# EAGLE design Registers (EAGLE 7.6.0)
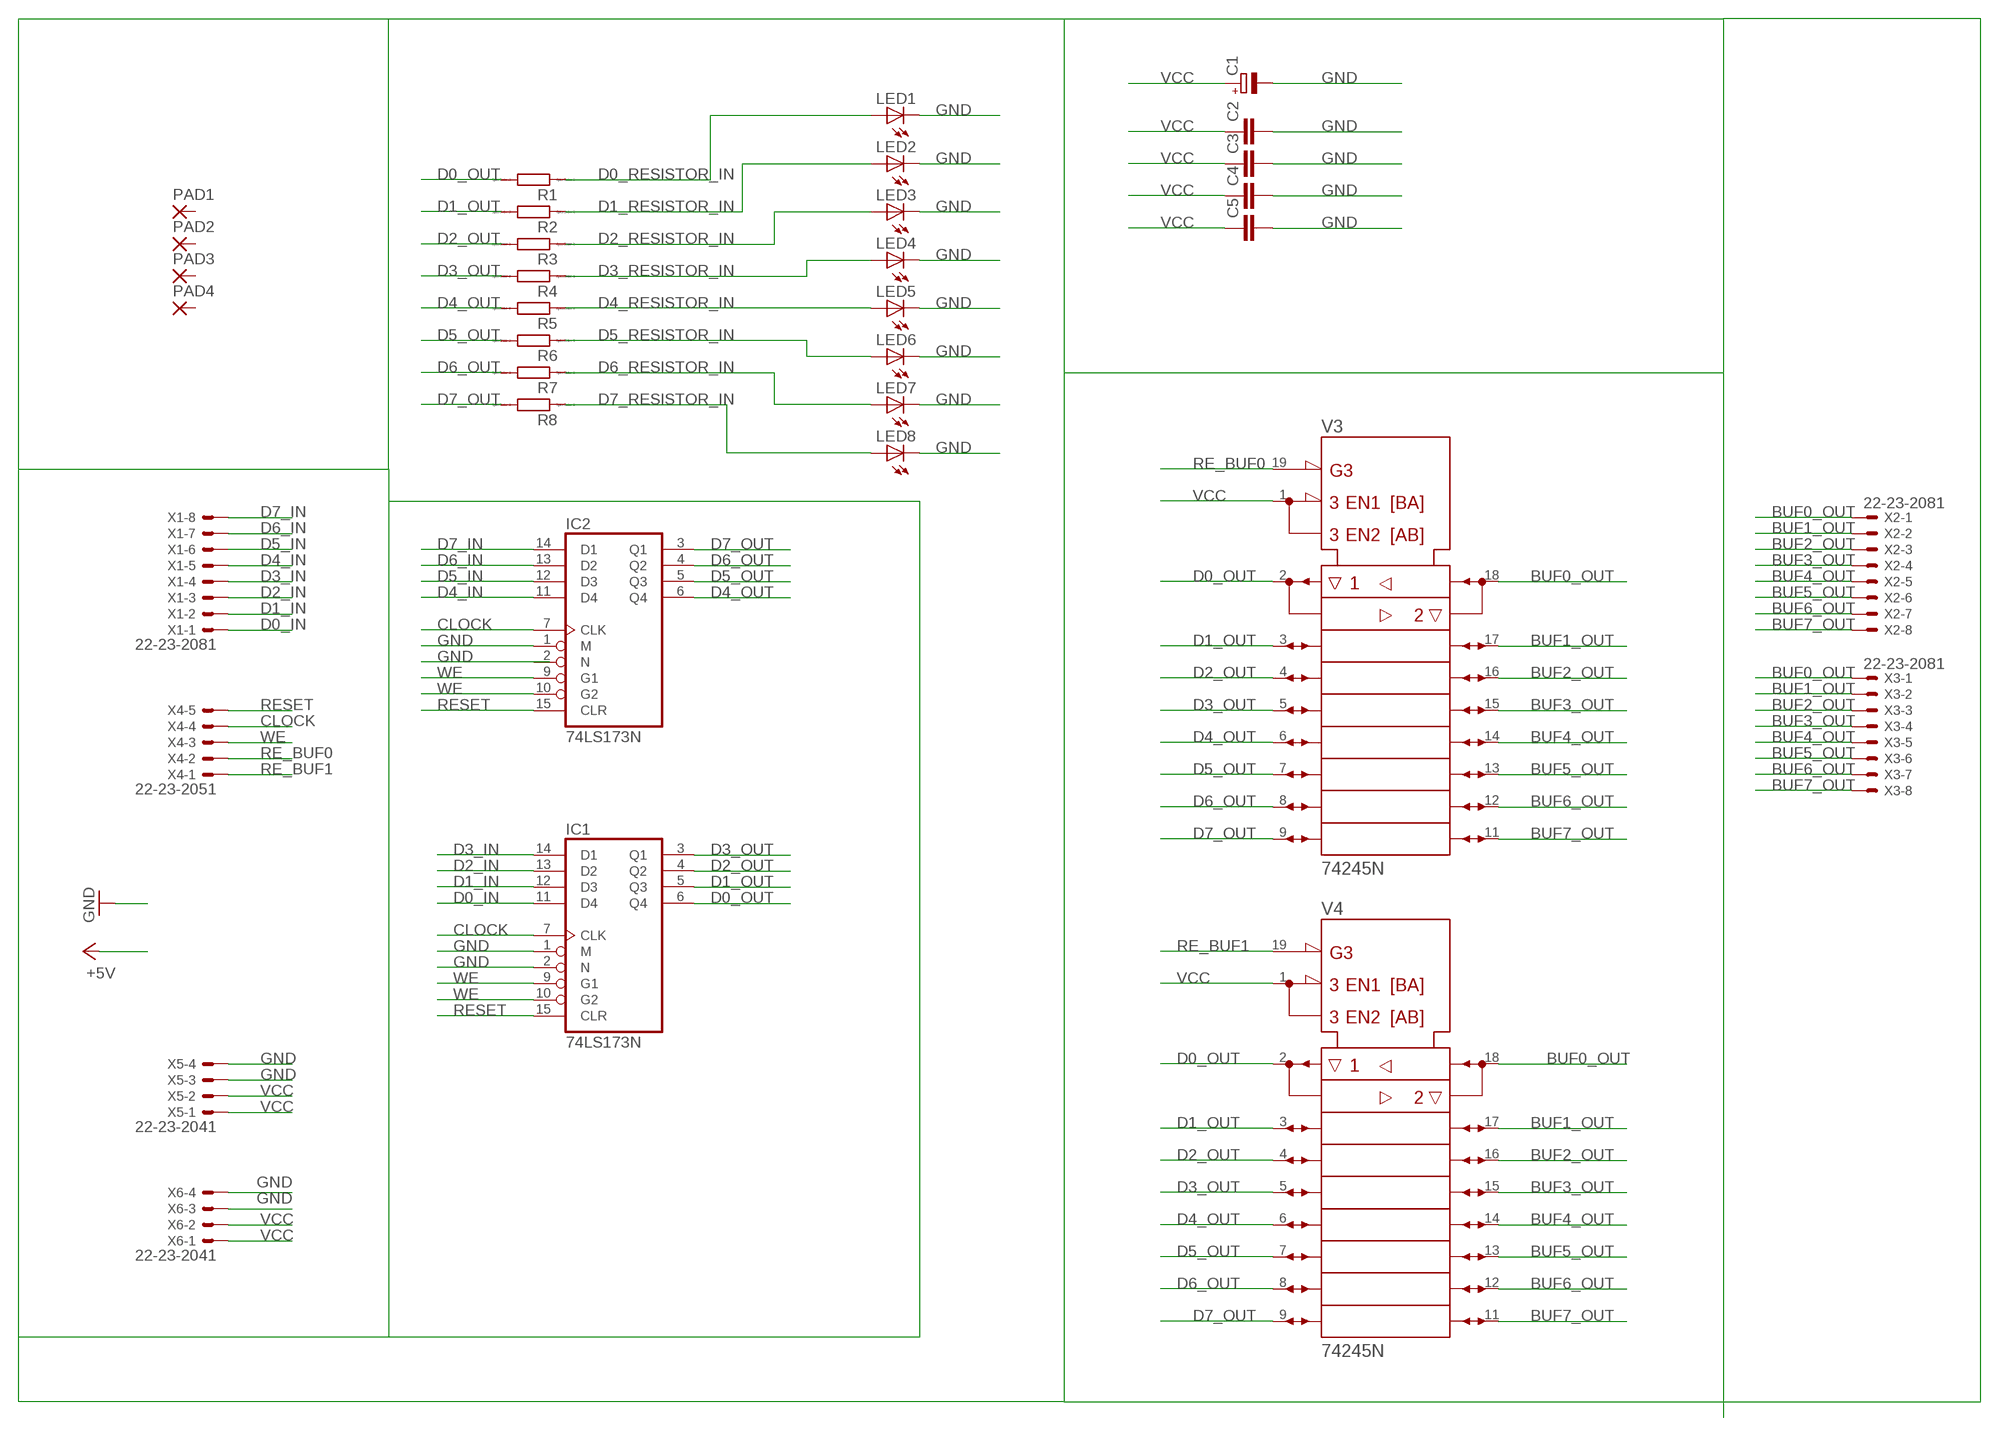
[diagram p0: schematic, sheet 1]

## Parts
C1  CPOL-EUE2.5-6  [E2,5-6]
C2  C-EU025-025X050  [C025-025X050]
C3  C-EU025-025X050  [C025-025X050]
C4  C-EU025-025X050  [C025-025X050]
C5  C-EU025-025X050  [C025-025X050]
IC1  74LS173N  [DIL16]
IC2  74LS173N  [DIL16]
LED1  LED5MM  [LED5MM]
LED2  LED5MM  [LED5MM]
LED3  LED5MM  [LED5MM]
LED4  LED5MM  [LED5MM]
LED5  LED5MM  [LED5MM]
LED6  LED5MM  [LED5MM]
LED7  LED5MM  [LED5MM]
LED8  LED5MM  [LED5MM]
PAD1  2,54/1,1  [2,54/1,1]
PAD2  2,54/1,1  [2,54/1,1]
PAD3  2,54/1,1  [2,54/1,1]
PAD4  2,54/1,1  [2,54/1,1]
R1  R0207/10  [0207/10]
R2  R0207/10  [0207/10]
R3  R0207/10  [0207/10]
R4  R0207/10  [0207/10]
R5  R0207/10  [0207/10]
R6  R0207/10  [0207/10]
R7  R0207/10  [0207/10]
R8  R0207/10  [0207/10]
V3  74245N  [DIL20]
V4  74245N  [DIL20]
X1  22-23-2081  [22-23-2081]
X2  22-23-2081  [22-23-2081]
X3  22-23-2081  [22-23-2081]
X4  22-23-2051  [22-23-2051]
X5  22-23-2041  [22-23-2041]
X6  22-23-2041  [22-23-2041]

## Nets
BUF0_OUT: V3.18(B1) V4.18(B1) X2.1 X3.1
BUF1_OUT: V3.17(B2) V4.17(B2) X2.2 X3.2
BUF2_OUT: V3.16(B3) V4.16(B3) X2.3 X3.3
BUF3_OUT: V3.15(B4) V4.15(B4) X2.4 X3.4
BUF4_OUT: V3.14(B5) V4.14(B5) X2.5 X3.5
BUF5_OUT: V3.13(B6) V4.13(B6) X2.6 X3.6
BUF6_OUT: V3.12(B7) V4.12(B7) X2.7 X3.7
BUF7_OUT: V3.11(B8) V4.11(B8) X2.8 X3.8
CLOCK: IC1.7(CLK) IC2.7(CLK) X4.4
D0_IN: IC1.11(D4) X1.1
D0_OUT: IC1.6(Q4) R1.2 V3.2(A1) V4.2(A1)
D0_RESISTOR_IN: LED1.A R1.1
D1_IN: IC1.12(D3) X1.2
D1_OUT: IC1.5(Q3) R2.2 V3.3(A2) V4.3(A2)
D1_RESISTOR_IN: LED2.A R2.1
D2_IN: IC1.13(D2) X1.3
D2_OUT: IC1.4(Q2) R3.2 V3.4(A3) V4.4(A3)
D2_RESISTOR_IN: LED3.A R3.1
D3_IN: IC1.14(D1) X1.4
D3_OUT: IC1.3(Q1) R4.2 V3.5(A4) V4.5(A4)
D3_RESISTOR_IN: LED4.A R4.1
D4_IN: IC2.11(D4) X1.5
D4_OUT: IC2.6(Q4) R5.2 V3.6(A5) V4.6(A5)
D4_RESISTOR_IN: LED5.A R5.1
D5_IN: IC2.12(D3) X1.6
D5_OUT: IC2.5(Q3) R6.2 V3.7(A6) V4.7(A6)
D5_RESISTOR_IN: LED6.A R6.1
D6_IN: IC2.13(D2) X1.7
D6_OUT: IC2.4(Q2) R7.2 V3.8(A7) V4.8(A7)
D6_RESISTOR_IN: LED7.A R7.1
D7_IN: IC2.14(D1) X1.8
D7_OUT: IC2.3(Q1) R8.2 V3.9(A8) V4.9(A8)
D7_RESISTOR_IN: LED8.A R8.1
GND [supply]: C1.- C2.2 C3.2 C4.2 C5.2 IC1.1(M) IC1.2(N) IC2.1(M) LED1.K(C) LED2.K(C) LED3.K(C) LED4.K(C) LED5.K(C) LED6.K(C) LED7.K(C) LED8.K(C) X5.3 X5.4 X6.3 X6.4
RE_BUF0: V3.19(!G) X4.2
RE_BUF1: V4.19(!G) X4.1
RESET: IC1.15(CLR) IC2.15(CLR) X4.5
VCC [supply]: C1.+ C2.1 C3.1 C4.1 C5.1 V3.1(DIR) V4.1(DIR) X5.1 X5.2 X6.1 X6.2 ; supply symbol labelled +5V
WE: IC1.9(G1) IC1.10(G2) IC2.9(G1) IC2.10(G2) X4.3
Unconnected: IC2.2(N) PAD1.1(P) PAD2.1(P) PAD3.1(P) PAD4.1(P)

## Power pins joined to a net without a drawn wire
GND: IC1.8(GND) IC2.8(GND) V3.10(-UB) V4.10(-UB)
VCC: IC1.16(VCC) IC2.16(VCC) V3.20(+UB) V4.20(+UB)

## Library data of the parts
C1 = rcl:CPOL-EU: POLARIZED CAPACITOR, European symbol
C2-C5 = rcl:C-EU: CAPACITOR, European symbol
IC1 IC2 = 74xx-us:74*173: 4-bit D type REGISTER, 3-state
LED1-LED8 = led:LED: LED OSRAM: - CHIPLED LG R971, LG N971, LY N971, LG Q971, LY Q971, LO R971, LY R971 LH N974, LH R974 LS Q976, LO Q976, LY Q976 LO Q996 - Hyper CHIPLED LW Q18S LB Q993, LB Q99A, LB R99A - SideLED LS A670, LO A670, LY A670, LG A670, LP A670 LB A673, LV A673, LT A673, LW A673 LH A674 LY A675 LS A676, LA A676, LO A676, LY A676, LW A676 LS A679, LY A679, LG A679 - Hyper Micro SIDELED® LS Y876, LA Y876, LO Y876, LY Y876 LT Y87S - SmartLED LW L88C, LW L88S LB L89C, LB L89S, LG L890 LS L89K, LO L89K, LY L89K LS L896, LA L896, LO L896, LY L896 - TOPLED LS T670, LO T670, LY T670, LG T670, LP T670 LSG T670, LSP T670, LSY T670, LOP T670, LYG T670 LG T671, LOG T671, LSG T671 LB T673, LV T673, LT T673, LW T673 LH T674 LS T676, LA T676, LO T676, LY T676, LB T676, LH T676, LSB T676, LW T676 LB T67C, LV T67C, LT T67C, LS T67K, LO T67K, LY T67K, LW E67C LS E67B, LA E67B, LO E67B, LY E67B, LB E67C, LV E67C, LT E67C LW T67C LS T679, LY T679, LG T679 LS T770, LO T770, LY T770, LG T770, LP T770 LB T773, LV T773, LT T773, LW T773 LH T774 LS E675, LA E675, LY E675, LS T675 LS T776, LA T776, LO T776, LY T776, LB T776 LHGB T686 LT T68C, LB T68C - Hyper Mini TOPLED® LB M676 - Mini TOPLED Santana® LG M470 LS M47K, LO M47K, LY M47K Source: http://www.osram.convergy.de LUXEON: - LUMILED® LXK2-PW12-R00, LXK2-PW12-S00, LXK2-PW14-U00, LXK2-PW14-V00 LXK2-PM12-R00, LXK2-PM12-S00, LXK2-PM14-U00 LXK2-PE12-Q00, LXK2-PE12-R00, LXK2-PE12-S00, LXK2-PE14-T00, LXK2-PE14-U00 LXK2-PB12-K00, LXK2-PB12-L00, LXK2-PB12-M00, LXK2-PB14-N00, LXK2-PB14-P00, LXK2-PB14-Q00 LXK2-PR12-L00, LXK2-PR12-M00, LXK2-PR14-Q00, LXK2-PR14-R00 LXK2-PD12-Q00, LXK2-PD12-R00, LXK2-PD12-S00 LXK2-PH12-R00, LXK2-PH12-S00 LXK2-PL12-P00, LXK2-PL12-Q00, LXK2-PL12-R00 Source: www.luxeon.com KINGBRIGHT: KA-3528ASYC Source: www.kingbright.com
PAD1-PAD4 = wirepad:2,54/1,1: THROUGH-HOLE PAD
R1-R8 = eagle-ltspice:R: RESISTOR, European symbol; SPICEMODEL: NONE; SPICEPREFIX: R
V3 V4 = 74ttl-din:74*245: Octal BUS TRANSCEIVER, 3-state
X1-X3 = con-molex:22-23-2081: .100" (2.54mm) Center Header - 8 Pin; MF: MOLEX; MPN: 22-23-2081; OC_FARNELL: 1756826; OC_NEWARK: 01C7592
X4 = con-molex:22-23-2051: .100" (2.54mm) Center Header - 5 Pin; MF: MOLEX; MPN: 22-23-2051; OC_FARNELL: 1462952; OC_NEWARK: 38C9178
X5 X6 = con-molex:22-23-2041: .100" (2.54mm) Center Header - 4 Pin; MF: MOLEX; MPN: 22-23-2041; OC_FARNELL: 1462920; OC_NEWARK: 38C0355

## Net classes
1 supply: width 1.016 mm

## Board
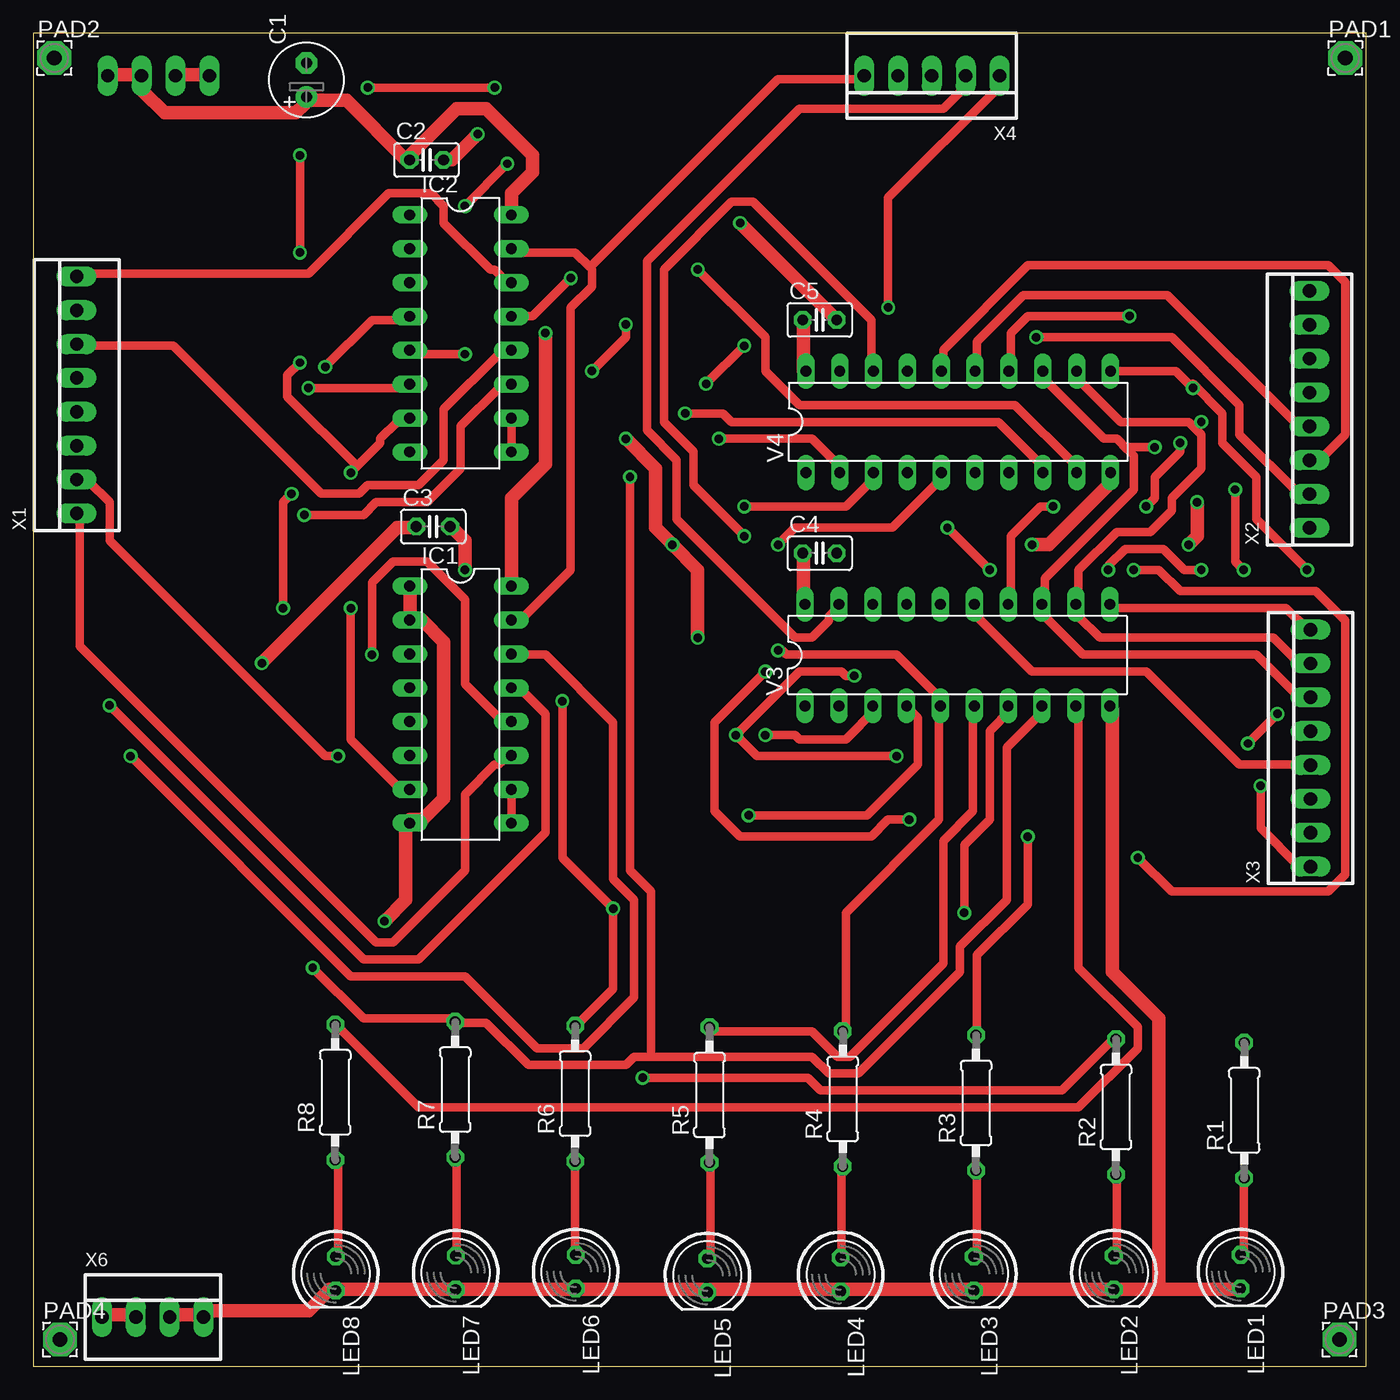
[diagram p1: board, top side]
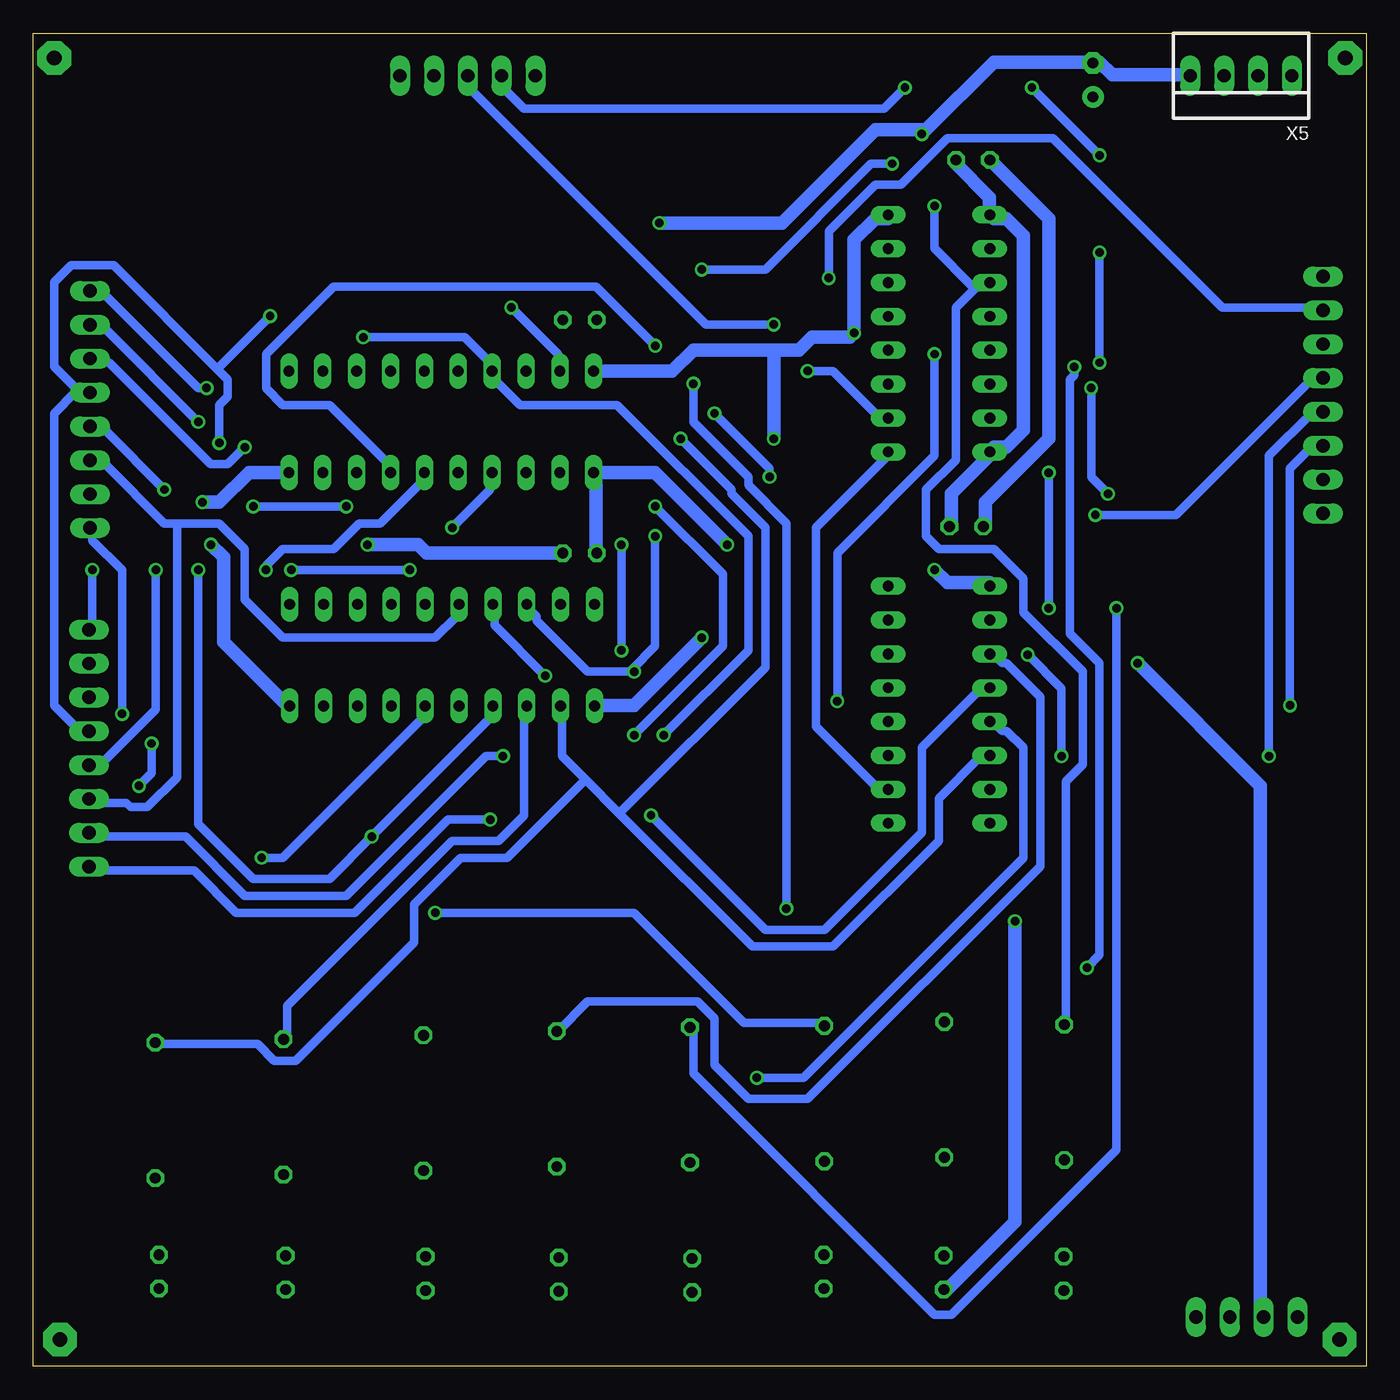
[diagram p2: board, bottom side, seen from below]

Size 100 x 100 mm. Coordinates in mm from the lower left corner, seen from the top.
Outline: 0,0 100,0 100,100 0,100 0,0
Copper layers (1*16): Top 0.035mm / dielectric 1.5mm / Bottom 0.035mm
Design rules "default *": minimum track width 25mil, minimum drill 25mil, track to track 25mil, track to pad 25mil, pad to pad 25mil, via to via 25mil, smd to smd 8mil, copper to edge 40mil, drill to drill 8mil, minimum pad ring 10mil, minimum via ring 8mil, stop-mask expansion 4mil, vias tented up to drill 0mil, thermal gap 10mil

### Footprints (pad centres in the part's own frame; a part is rotated, then mirrored left to right if it is on the bottom)
E2,5-6 = drill 0.813 pad 1.6: + -1.27,0 | drill 0.813 pad 1.6 octagon: - 1.27,0
C025-025X050 = drill 0.813 octagon: 1 -1.27,0; 2 1.27,0
DIL16 = drill 0.813 long: 1 -8.89,-3.81; 2 -6.35,-3.81; 3 -3.81,-3.81; 4 -1.27,-3.81; 5 1.27,-3.81; 6 3.81,-3.81; 7 6.35,-3.81; 8 8.89,-3.81; 9 8.89,3.81; 10 6.35,3.81; 11 3.81,3.81; 12 1.27,3.81; 13 -1.27,3.81; 14 -3.81,3.81; 15 -6.35,3.81; 16 -8.89,3.81
LED5MM = drill 0.813 octagon: A -1.27,0; K 1.27,0
2,54/1,1 = drill 1.118 pad 2.54 octagon: 1 0,0
0207/10 = drill 0.813 octagon: 1 -5.08,0; 2 5.08,0
DIL20 = drill 0.813 long: 1 -11.43,-3.81; 2 -8.89,-3.81; 3 -6.35,-3.81; 4 -3.81,-3.81; 5 -1.27,-3.81; 6 1.27,-3.81; 7 3.81,-3.81; 8 6.35,-3.81; 9 8.89,-3.81; 10 11.43,-3.81; 11 11.43,3.81; 12 8.89,3.81; 13 6.35,3.81; 14 3.81,3.81; 15 1.27,3.81; 16 -1.27,3.81; 17 -3.81,3.81; 18 -6.35,3.81; 19 -8.89,3.81; 20 -11.43,3.81
22-23-2081 = drill 1 long: 1 -8.89,0; 2 -6.35,0; 3 -3.81,0; 4 -1.27,0; 5 1.27,0; 6 3.81,0; 7 6.35,0; 8 8.89,0
22-23-2051 = drill 1 long: 1 -5.08,0; 2 -2.54,0; 3 0,0; 4 2.54,0; 5 5.08,0
22-23-2041 = drill 1 long: 1 -3.81,0; 2 -1.27,0; 3 1.27,0; 4 3.81,0

### Placement (x,y rotation side)
C1  20.5,96.5 90 top
C2  29.5,90.5 0 top
C3  30,63 0 top
C4  59,61 0 top
C5  59,78.5 0 top
IC1  32.05,49.63 270 top
IC2  32.05,77.49 270 top
LED1  90.57,7.09 270 top
LED2  81.07,7.02 270 top
LED3  70.57,6.95 270 top
LED4  60.57,6.88 270 top
LED5  50.57,6.81 270 top
LED6  40.69,7.09 270 top
LED7  31.69,7.02 270 top
LED8  22.69,6.95 270 top
PAD1  98.43,98.15 0 top
PAD2  1.58,98.15 0 top
PAD3  98,2 0 top
PAD4  2,2 0 top
R1  90.85,19.19 90 top
R2  81.23,19.45 90 top
R3  70.73,19.75 90 top
R4  60.73,20.05 90 top
R5  50.73,20.35 90 top
R6  40.65,20.45 90 top
R7  31.65,20.75 90 top
R8  22.65,20.55 90 top
V3  69.33,53.35 0 top
V4  69.39,70.85 0 top
X1  3.25,72.87 90 top
X2  95.75,71.78 90 top
X3  95.82,46.37 90 top
X4  67.41,96.82 180 top
X5  9.39,96.82 180 bottom
X6  8.96,3.68 0 top

### Tracks (layer width: path | path; a pad name or v marks a point on that pad's centre or on a via)
BUF0_OUT  (via drill 0.64)
  Top 0.635: v91.12,46.72 v93.34,48.94 | v92.08,43.55 92.08,40.37 94.93,37.51 95.57,37.51 X3.1 | v53.34,62.28 49.53,66.09 49.53,68.63 47.31,70.85 47.31,82.28 52.39,87.36 53.98,87.36 62.87,78.47 62.87,74.66 V4.18 | v65.72,41.01 64.14,41.01 62.87,39.73 53.02,39.73 51.12,41.64 51.12,48.31 v54.93,52.12
  Bottom 0.635: v93.34,48.94 93.34,59.74 95.57,61.96 95.57,62.59 X2.1 | v91.12,46.72 91.12,44.5 v92.08,43.55 | 55.09,52.28 53.34,54.02 v53.34,62.28 | 55.09,52.28 55.24,52.12 58.42,52.12 62.23,55.93 62.23,56.24 62.87,56.88 V3.18 | v65.72,41.01 68.9,41.01 75.88,34.02 84.77,34.02 87.95,37.2 95.57,37.2 X3.1 | v54.93,52.12 55.09,52.28
BUF1_OUT  (via drill 0.64)
  Top 0.635: v61.59,51.8 60.96,51.8 60.64,52.12 57.47,52.12 v52.7,47.35 54.29,45.77 v64.77,45.77 | v75.25,77.2 85.41,77.2 90.49,72.12 90.49,69.9 94.93,65.45 95.57,65.45 X2.2
  Bottom 0.635: v61.59,51.8 65.41,55.61 65.41,56.88 V3.17 | v52.7,47.35 46.35,53.7 46.35,62.28 56.2,72.12 63.5,72.12 65.41,74.03 65.41,74.66 V4.17 65.72,74.66 65.72,75.3 67.63,77.2 v75.25,77.2 | v64.77,45.77 66.04,45.77 76.52,35.29 84.14,35.29 88.58,39.73 95.57,39.73 X3.2
BUF2_OUT
  Top 0.635: V4.16 68.26,74.66 68.26,76.25 74.61,82.6 97.16,82.6 98.42,81.33 98.42,69.9 96.52,67.99 95.89,67.99 X2.3
  Bottom 0.635: 89.22,63.23 90.17,63.23 94.61,67.67 95.57,67.67 X2.3 | 89.22,63.23 86.04,63.23 84.14,61.33 84.14,57.52 81.28,54.66 69.85,54.66 68.26,56.24 68.26,56.88 V3.16 | 89.22,63.23 89.22,44.18 91.44,41.96 92.71,41.96 93.03,42.27 95.57,42.27 X3.3
BUF3_OUT  (via drill 0.64)
  Top 0.635: V4.15 70.8,74.66 70.8,76.88 74.3,80.38 85.09,80.38 94.93,70.53 95.57,70.53 X2.4 | V3.15 70.8,56.88 70.8,56.24 74.93,52.12 83.5,52.12 90.49,45.13 95.57,45.13 X3.4 | v90.17,65.77 90.17,60.37 v90.81,59.74
  Bottom 0.635: v90.17,65.77 94.61,70.22 95.57,70.22 X2.4 | v90.81,59.74 90.81,49.26 94.93,45.13 95.57,45.13 X3.4
BUF4_OUT  (via drill 0.64)
  Top 0.635: v76.52,64.5 75.56,64.5 73.34,62.28 73.34,57.2 V3.14 | v83.5,64.5 84.14,65.14 84.14,66.72 86.04,68.63 v86.04,69.26 | v82.23,78.79 74.61,78.79 73.34,77.52 73.34,74.66 V4.14
  Bottom 0.635: v83.5,64.5 v76.52,64.5 | v86.04,69.26 86.04,72.12 85.41,72.75 85.41,74.03 86.2,74.82 | 86.2,74.82 93.98,82.6 97.16,82.6 98.42,81.33 98.42,74.98 96.52,73.07 95.89,73.07 X2.5 96.84,73.07 98.42,71.48 98.42,49.58 96.52,47.67 95.89,47.67 X3.5 | 86.2,74.82 v82.23,78.79
BUF5_OUT  (via drill 0.64)
  Top 0.635: X3.6 95.57,50.21 94.93,50.21 91.76,53.39 78.74,53.39 75.88,56.24 75.88,56.88 V3.13 75.88,57.2 75.88,59.1 82.55,65.77 82.55,68.31 82.07,68.79 | 82.07,68.79 81.28,69.58 80.33,69.58 75.88,74.03 75.88,74.66 V4.13 | v84.14,68.94 82.23,68.94 82.07,68.79
  Bottom 0.635: v84.14,68.94 85.41,67.67 86.68,67.67 94.3,75.3 95.57,75.3 X2.6
BUF6_OUT  (via drill 0.64)
  Top 0.635: X3.7 95.57,52.75 94.93,52.75 93.03,54.66 80.01,54.66 78.42,56.24 78.42,56.88 V3.12 78.42,57.2 78.42,59.74 81.28,62.59 83.82,62.59 85.41,64.18 85.41,65.14 87.63,67.36 87.63,69.9 87.15,70.37 | 87.15,70.37 86.68,70.85 81.6,70.85 78.42,74.03 78.42,74.66 V4.12 | 87.15,70.37 v87.63,70.85
  Bottom 0.635: v87.63,70.85 94.61,77.83 95.57,77.83 X2.7
BUF7_OUT  (via drill 0.64)
  Top 0.635: V3.11 80.96,56.88 93.98,56.88 95.57,55.29 X3.8 | V4.11 85.72,74.66 v87,73.39 87,73.71 89.22,71.48 89.22,69.26 91.76,66.72 91.76,63.55 v95.57,59.74
  Bottom 0.635: v87,73.39 87.63,73.39 94.61,80.38 95.57,80.38 X2.8 | v95.57,59.74 95.57,55.29 X3.8
CLOCK  (via drill 0.64)
  Top 0.635: v23.81,56.88 23.81,47.04 27.3,43.55 27.94,43.55 IC1.7 | 24.29,67.52 26.04,69.26 26.04,69.58 27.3,70.85 27.94,70.85 IC2.7 | 24.29,67.52 v23.81,67.04 | v25.08,95.93 v34.61,95.93 | v20,83.55 v20,90.85 | v20,75.3 19.05,74.34 19.05,72.75 24.29,67.52
  Bottom 0.635: v23.81,67.04 v23.81,56.88 | v34.61,95.93 36.2,94.34 63.18,94.34 64.77,95.93 64.77,96.57 X4.4 | v20,90.85 v25.08,95.93 | v20,75.3 v20,83.55
D0_IN
  Top 0.635: IC1.11 35.56,45.77 34.92,45.13 34.61,45.13 32.38,42.91 32.38,37.2 26.99,31.8 25.72,31.8 3.49,54.02 3.49,63.87 X1.1
D0_OUT  (via drill 0.64)
  Top 0.635: v51.44,69.58 58.42,69.58 60.33,67.67 60.33,67.04 V4.2
  Bottom 0.635: 58.58,44.02 60.33,45.77 60.33,49.26 V3.2 | 58.58,44.02 56.04,41.48 | 56.04,41.48 46.04,31.48 40.01,31.48 32.07,39.42 32.07,42.59 28.89,45.77 28.26,45.77 IC1.6 | 58.58,44.02 64.45,38.15 67.94,38.15 71.44,34.66 71.44,31.8 80.33,22.91 81.92,22.91 83.19,24.18 90.81,24.18 R1.2 | v51.44,69.58 47.62,65.77 47.62,65.45 45.09,62.91 45.09,52.44 56.04,41.48
D0_RESISTOR_IN
  Top 0.635: LED1.A 90.81,8.62 90.81,14.02 R1.1
D1_IN  (via drill 0.64)
  Top 0.635: v25.4,53.39 25.4,58.78 26.99,60.37 29.53,60.37 32.38,57.52 32.38,51.16 34.92,48.62 35.56,48.62 IC1.12 | v22.86,45.77 21.91,45.77 5.71,61.96 5.71,64.82 4.13,66.41 3.49,66.41 X1.2
  Bottom 0.635: v25.4,53.39 22.86,50.85 v22.86,45.77
D1_OUT  (via drill 0.64)
  Top 0.635: v45.72,21.64 58.1,21.64 59.05,20.68 77.15,20.68 80.96,24.5 R2.2 | v53.34,64.5 60.96,64.5 62.87,66.41 62.87,67.04 V4.3 | v54.93,47.35 57.15,47.35 57.47,47.04 60.96,47.04 63.18,49.26 V3.3
  Bottom 0.635: v45.72,21.64 42.23,21.64 25.72,38.15 25.72,46.4 26.99,47.67 27.3,47.67 27.94,48.31 IC1.5 | V3.3 63.18,49.26 63.18,41.32 65.09,39.42 68.58,39.42 80.96,27.04 80.96,24.81 R2.2 | v53.34,64.5 48.26,59.42 48.26,54.02 v54.93,47.35
D1_RESISTOR_IN
  Top 0.635: LED2.A 81.28,8.3 81.28,14.34 R2.1
D2_IN  (via drill 0.64)
  Top 0.635: v5.71,49.58 24.77,30.53 28.89,30.53 38.42,40.05 38.42,48.94 36.51,50.85 35.88,50.85 IC1.13
  Bottom 0.635: v5.71,49.58 5.71,67.36 4.13,68.94 3.49,68.94 X1.3
D2_OUT  (via drill 0.64)
  Top 0.635: v74.61,39.73 74.61,34.66 70.8,30.84 70.8,25.13 R3.2 | v53.66,41.32 62.55,41.32 66.36,45.13 66.36,48.62 65.72,49.26 V3.4 | v71.75,59.74 v68.58,62.91 | v80.64,59.74 80.64,60.05 81.92,61.33 84.77,61.33 86.36,59.74 v87.63,59.74
  Bottom 0.635: V3.4 65.72,49.26 65.72,48.62 v74.61,39.73 77.79,36.56 83.5,36.56 87.63,40.69 v87.63,59.74 | v53.66,41.32 45.09,32.75 40.64,32.75 33.34,40.05 33.34,46.4 28.89,50.85 28.26,50.85 IC1.4 | v68.58,62.91 65.72,65.77 65.72,67.04 V4.4 | v80.64,59.74 v71.75,59.74
D2_RESISTOR_IN
  Top 0.635: LED3.A 70.8,8.3 70.8,14.65 R3.1
D3_IN  (via drill 0.64)
  Top 0.635: v7.3,45.77 23.81,29.26 32.38,29.26 37.78,23.86 41.27,23.86 45.09,27.67 45.09,34.97 43.5,36.56 43.5,48.31 38.42,53.39 35.88,53.39 IC1.14
  Bottom 0.635: v7.3,45.77 7.3,68.31 4.13,71.48 3.49,71.48 X1.4
D3_OUT  (via drill 0.64)
  Top 0.635: R4.2 60.96,25.13 60.96,34.02 67.94,41.01 67.94,49.26 V3.5 67.94,49.58 67.94,50.21 64.77,53.39 56.52,53.39 56.2,53.7 v55.88,53.7 | v55.88,61.64 57.15,62.91 64.45,62.91 67.94,66.41 67.94,67.04 V4.5
  Bottom 0.635: IC1.3 27.94,53.39 27.3,52.75 26.99,52.75 24.45,50.21 24.45,37.51 41.91,20.05 46.35,20.05 48.9,22.59 48.9,26.08 50.16,27.35 58.42,27.35 60.64,25.13 R4.2 | v55.88,53.7 v55.88,61.64
D3_RESISTOR_IN
  Top 0.635: LED4.A 60.64,8.3 60.64,14.97 R4.1
D4_IN  (via drill 0.64)
  Top 0.635: v20.32,63.87 24.77,63.87 25.72,64.82 29.53,64.82 32.07,67.36 32.07,70.53 34.92,73.39 35.56,73.39 IC2.11
  Bottom 0.635: v20.32,63.87 14.29,63.87 4.13,74.03 3.49,74.03 X1.5
D4_OUT  (via drill 0.64)
  Top 0.635: R5.2 50.8,25.13 58.42,25.13 60.33,23.23 61.28,23.23 68.26,30.21 68.26,39.42 70.48,41.64 70.48,49.26 V3.6 | v20.64,73.39 27.94,73.39 IC2.6 | v19.37,65.45 18.73,64.82 v18.73,56.88 | v82.55,59.74 84.45,59.74 86.04,58.15 96.2,58.15 98.42,55.93 98.42,36.88 97.16,35.61 85.41,35.61 v82.87,38.15
  Bottom 0.635: v20.64,73.39 20.64,66.72 v19.37,65.45 | v18.73,56.88 18.73,16.24 31.11,3.86 32.38,3.86 50.48,21.95 50.48,25.13 R5.2 | v82.55,59.74 82.55,60.05 81.28,61.33 77.47,61.33 75.56,63.23 73.98,63.23 70.8,66.41 70.8,67.04 V4.6 | v82.87,38.15 81.28,38.15 70.8,48.62 70.8,49.26 V3.6
D4_RESISTOR_IN
  Top 0.635: LED5.A 50.8,8.3 50.8,14.97 R5.1
D5_IN
  Top 0.635: IC2.12 35.56,75.93 34.92,75.93 30.8,71.8 30.8,67.99 28.89,66.09 25.08,66.09 24.45,65.45 21.59,65.45 10.48,76.56 3.49,76.56 X1.6
D5_OUT  (via drill 0.64)
  Top 0.635: v69.85,34.02 69.85,39.1 71.75,41.01 71.75,47.67 73.34,49.26 V3.7 | v50.48,73.71 v53.34,76.56 | R6.2 40.96,25.77 43.5,28.3 v43.5,34.34 39.69,38.15 v39.69,49.9 | v32.38,75.93 28.26,75.93 IC2.5
  Bottom 0.635: v69.85,34.02 54.93,34.02 46.67,25.77 40.96,25.77 R6.2 | v53.34,76.56 57.78,81.01 77.47,81.01 82.55,75.93 82.55,73.39 81.28,72.12 77.79,72.12 73.34,67.67 73.34,67.04 V4.7 | v50.48,73.71 50.48,70.85 46.35,66.72 46.35,66.09 43.5,63.23 v43.5,34.34 | v32.38,75.93 32.38,68.31 39.69,61.01 v39.69,49.9
D5_RESISTOR_IN
  Top 0.635: R6.1 40.64,15.29 40.64,8.62 LED6.A
D6_IN  (via drill 0.64)
  Top 0.635: v40.32,81.64 37.47,78.79 35.88,78.79 IC2.13
  Bottom 0.635: v40.32,81.64 40.32,85.14 36.83,88.63 34.92,88.63 31.43,92.12 23.5,92.12 10.79,79.42 3.49,79.42 X1.7
D6_OUT  (via drill 0.64)
  Top 0.635: 46.35,23.23 58.42,23.23 59.69,21.95 61.91,21.95 69.53,29.57 69.53,31.48 73.03,34.97 73.03,46.4 75.88,49.26 V3.8 | 46.35,23.23 45.09,23.23 44.45,22.59 37.15,22.59 33.97,25.77 31.75,25.77 R7.2 31.43,26.08 24.77,26.08 v20.95,29.89 | v48.9,71.48 51.75,71.48 52.39,70.85 72.39,70.85 75.56,67.67 75.56,67.04 V4.8 | v44.77,66.72 44.77,37.2 46.35,35.61 46.35,23.23 | v21.91,74.98 25.4,78.47 27.94,78.47 IC2.4
  Bottom 0.635: v48.9,71.48 44.77,67.36 v44.77,66.72 | v21.91,74.98 21.91,74.34 22.23,74.03 22.23,54.98 20,52.75 20,30.84 v20.95,29.89
D6_RESISTOR_IN
  Top 0.635: R7.1 31.75,15.61 31.75,8.3 LED7.A
D7_IN
  Top 0.635: IC2.14 35.56,81.33 34.61,82.28 34.29,82.28 30.8,85.77 30.8,87.04 29.84,88 26.67,88 20.64,81.96 3.49,81.96 X1.8
D7_OUT  (via drill 0.64)
  Top 0.635: V3.9 78.42,49.26 78.42,29.89 82.87,25.45 82.87,23.86 78.42,19.41 28.89,19.41 22.86,25.45 R8.2 | v49.85,82.28 54.93,77.2 54.93,74.66 57.47,72.12 73.66,72.12 78.11,67.67 78.11,67.04 V4.9 | v32.38,87.04 v35.56,90.22
  Bottom 0.635: R8.2 22.54,25.77 22.54,43.86 21.27,45.13 21.27,52.12 25.72,56.56 25.72,59.1 27.94,61.33 32.07,61.33 33.02,62.28 33.02,65.77 30.8,67.99 30.8,79.42 29.21,81.01 28.26,81.01 IC2.3 29.53,81.01 32.38,83.87 v32.38,87.04 | v49.85,82.28 45.09,82.28 37.15,90.22 v35.56,90.22
D7_RESISTOR_IN
  Top 0.635: R8.1 22.86,15.29 22.86,8.3 LED8.A
GND  (via drill 0.64)
  Top 1.016: IC1.1 28.26,58.47 28.26,56.24 IC1.2 28.26,55.93 29.21,55.93 30.8,54.34 30.8,42.59 29.21,41.01 28.26,41.01 IC1.8 27.94,40.37 27.94,34.97 v26.35,33.38 | v32.38,59.74 32.38,61.96 31.43,62.91 C3.2 | X5.3 10.79,96.89 13.02,96.89 X5.4 | v53.02,85.77 60.01,78.79 C5.2 | v33.34,92.44 31.43,90.53 30.8,90.53 C2.2 | X6.3 10.48,3.86 12.7,3.86 X6.4 13.02,4.17 20.64,4.17 22.23,5.76 LED8.K 22.86,5.76 31.43,5.76 LED7.K 32.07,5.76 40.64,5.76 LED6.K 40.96,5.76 50.16,5.76 LED5.K 50.8,5.76 60.33,5.76 LED4.K 60.96,5.76 70.48,5.76 LED3.K 70.8,5.76 80.64,5.76 LED2.K 81.28,5.76 84.45,5.76 | v74.93,61.64 76.2,61.64 80.64,66.09 80.64,67.04 V4.10 | 84.45,5.76 90.49,5.76 LED1.K | 84.45,5.76 84.45,26.08 80.96,29.57 80.96,49.26 V3.10 | v87.31,64.82 87.31,62.28 v86.68,61.64
  Bottom 1.016: C2.2 30.8,90.22 28.26,87.68 28.26,86.41 IC2.1 27.94,86.09 26.99,86.09 25.72,84.82 25.72,70.22 26.99,68.94 27.94,68.94 IC2.8 28.26,68.31 31.11,65.45 31.11,63.23 C3.2 | v32.38,59.74 31.43,58.78 28.26,58.78 IC1.1 | v53.02,85.77 43.81,85.77 36.83,92.76 33.34,92.76 | 33.34,92.76 33.02,92.76 27.94,97.84 20.64,97.84 C1.- 20,97.84 19.05,96.89 13.34,96.89 X5.4 | v33.34,92.44 33.34,92.76 | v74.93,61.64 71.12,61.64 70.48,61.01 60.33,61.01 C4.2 | V4.10 83.82,67.04 86.04,64.82 v87.31,64.82 | v86.68,61.64 85.72,60.69 85.72,54.34 80.96,49.58 V3.10 | v26.35,33.38 26.35,10.84 31.43,5.76 LED7.K
RE_BUF0
  Top 0.635: V3.19 60.33,56.88 59.69,56.24 59.69,55.93 58.42,54.66 57.15,54.66 48.26,63.55 48.26,67.99 46.04,70.22 46.04,82.92 57.47,94.34 68.26,94.34 69.85,95.93 69.85,96.57 X4.2
RE_BUF1  (via drill 0.64)
  Top 0.635: v64.14,79.42 64.14,87.68 72.39,95.93 72.39,96.57 X4.1
  Bottom 0.635: v64.14,79.42 60.64,75.93 60.64,74.66 V4.19
RESET
  Top 0.635: 41.75,82.44 40.64,83.55 35.88,83.55 IC2.15 | 41.75,82.44 41.91,82.28 41.91,81.01 40.32,79.42 40.32,59.74 36.83,56.24 35.88,56.24 IC1.15 | 41.75,82.44 55.88,96.57 62.23,96.57 X4.5
VCC  (via drill 0.64)
  Top 1.016: V3.20 57.78,57.2 57.78,60.69 C4.1 | v49.85,54.66 49.85,59.74 v47.94,61.64 46.67,62.91 46.67,67.36 v44.45,69.58 | V4.20 57.78,74.66 57.78,78.47 C5.1 | v38.42,77.52 38.42,67.67 35.88,65.14 35.88,58.78 IC1.16 | X5.1 5.71,96.89 7.94,96.89 X5.2 8.26,96.57 8.26,95.61 9.84,94.03 19.68,94.03 20.32,94.66 C1.+ 20.64,94.98 23.5,94.98 27.94,90.53 C2.1 28.26,90.85 31.75,94.34 33.97,94.34 37.47,90.85 37.47,89.58 35.88,88 35.88,86.41 IC2.16 | X6.1 5.4,3.86 7.62,3.86 X6.2 | v17.14,52.75 27.3,62.91 28.57,62.91 C3.1
  Bottom 1.016: v49.85,54.66 54.93,49.58 57.78,49.58 V3.1 | v47.94,61.64 53.34,67.04 V4.1 57.78,66.72 57.78,61.01 C4.1 | IC2.16 35.88,86.09 36.83,86.09 38.42,84.5 v38.42,77.52 38.73,77.2 41.59,77.2 42.55,76.25 44.45,76.25 | V4.20 52.07,74.66 50.48,76.25 44.45,76.25 | 44.45,76.25 v44.45,69.58 | C3.1 28.57,63.23 28.57,64.82 23.81,69.58 23.81,86.09 27.94,90.22 C2.1 | v17.14,52.75 7.94,43.55 7.94,3.86 X6.2
WE  (via drill 0.64)
  Top 0.635: IC1.9 35.88,41.01 35.88,43.23 IC1.10 | IC2.9 35.88,68.63 35.88,70.85 IC2.10 | v44.45,78.15 44.45,77.2 v41.91,74.66
  Bottom 0.635: v44.45,78.15 49.53,78.15 67.31,95.93 67.31,96.57 X4.3 | v41.91,74.66 40.01,74.66 36.51,71.17 35.88,71.17 IC2.10 | IC1.10 35.88,43.55 36.83,43.55 41.27,47.99 41.27,62.91 35.88,68.31 IC2.9